# Altium schematic sheet project_13.SchDoc
size A4; SheetNumber: 1; SheetTotal: 1
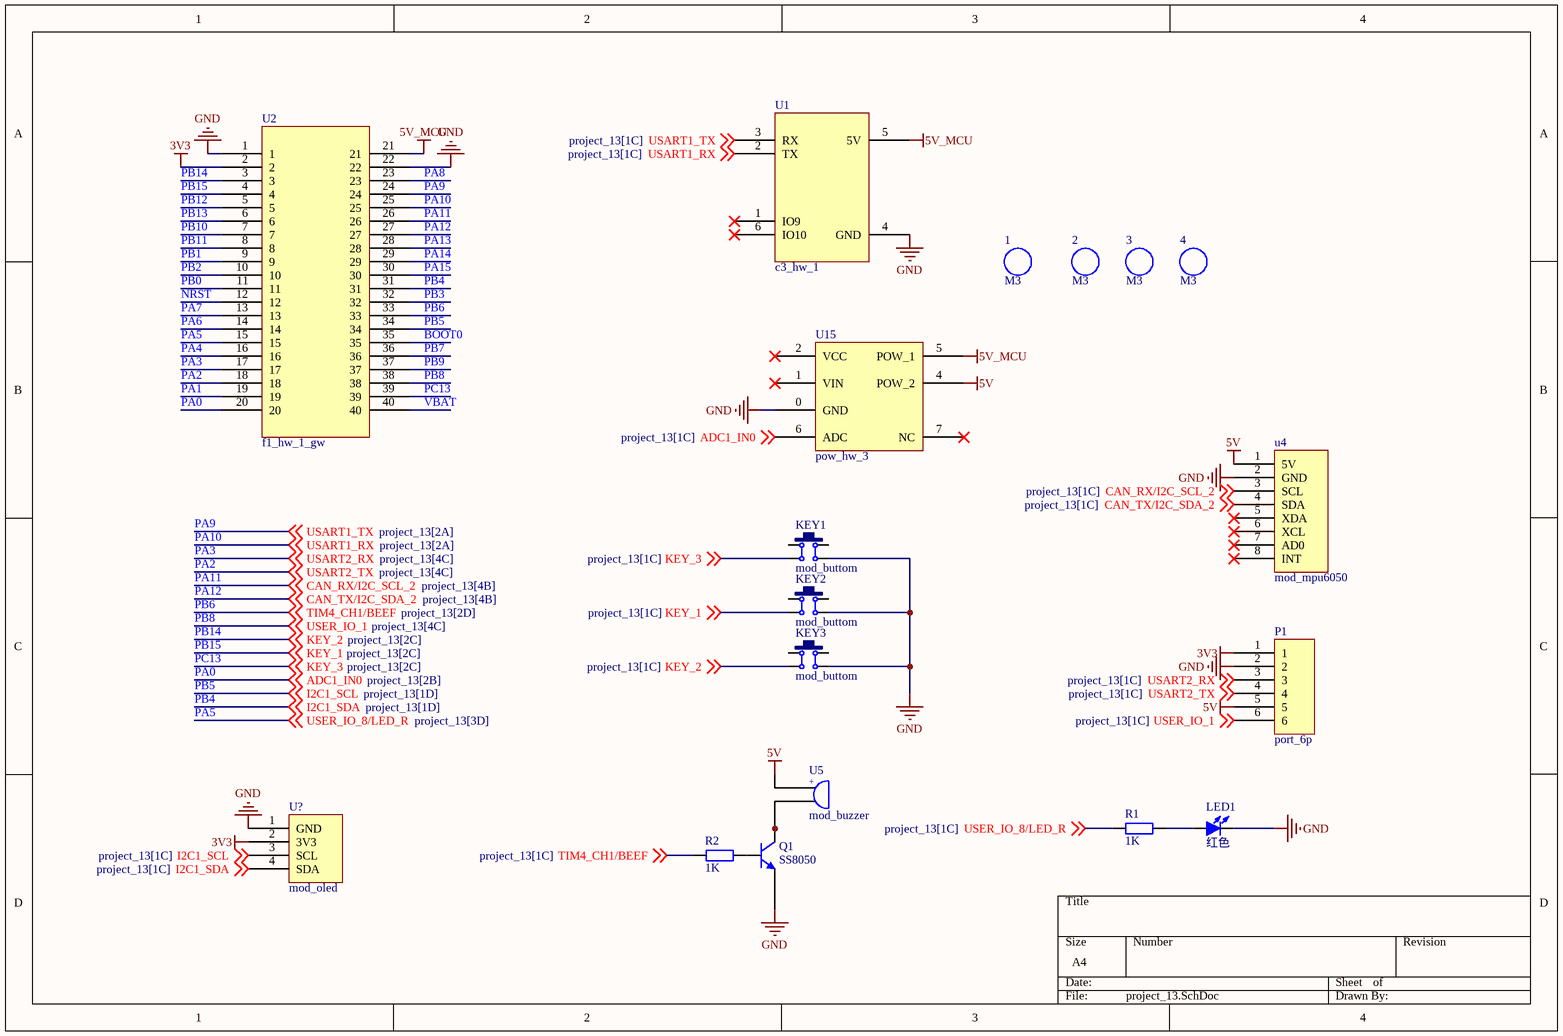
[diagram p0: project_13.SchDoc]

## Parts
1  M3  [M3 125X200]
2  M3  [M3 125X200]
3  M3  [M3 125X200]
4  M3  [M3 125X200]
KEY1  mod_buttom  [MOD_BUTTOM]
KEY2  mod_buttom  [MOD_BUTTOM]
KEY3  mod_buttom  [MOD_BUTTOM]
LED1  红色  [LED 3MM-R]
P1  port_6p  [MOD_GPS]
Q1  SS8050  [SOT23-3L]
R1  1K  [R 0603_L]
R2  1K  [R 0603_L]
U1  c3_hw_1  [C3_HW_1]
U2  f1_hw_1_gw  [F1_HW_1_GW]
u4  mod_mpu6050  [MOD_MPU6050]
U5  mod_buzzer  [MOD_BUZZER]
U15  pow_hw_3  [POW_HW_3]
U?  mod_oled  [mod_oled]

## Nets
3V3: P1.1 U2.2 U?.2(3V3)
5V: P1.5 u4.1(5V) U5.1 U15.4(POW_2)
5V_MCU: U1.5(5V) U2.21 U15.5(POW_1)
GND: KEY1.3 KEY2.3 KEY3.3 LED1.2(K) P1.2 Q1.2(E) U1.4(GND) U2.1 U2.22 u4.2(GND) U15.0(GND) U?.1(GND)
BOOT0: U2.35
NRST: U2.12
PA0: U2.20 U15.6(ADC) ; off-sheet ADC1_IN0  [also labelled ADC1_IN0]
PA1: U2.19
PA2: P1.4 U2.18 ; off-sheet USART2_TX  [also labelled USART2_TX]
PA3: P1.3 U2.17 ; off-sheet USART2_RX  [also labelled USART2_RX]
PA4: U2.16
PA5: R1.1 U2.15 ; off-sheet USER_IO_8/LED_R  [also labelled USER_IO_8/LED_R]
PA6: U2.14
PA7: U2.13
PA8: U2.23
PA9: U1.3(RX) U2.24 ; off-sheet USART1_TX  [also labelled USART1_TX]
PA10: U1.2(TX) U2.25 ; off-sheet USART1_RX  [also labelled USART1_RX]
PA11: U2.26 u4.3(SCL) ; off-sheet CAN_RX/I2C_SCL_2  [also labelled CAN_RX/I2C_SCL_2]
PA12: U2.27 u4.4(SDA) ; off-sheet CAN_TX/I2C_SDA_2  [also labelled CAN_TX/I2C_SDA_2]
PA13: U2.28
PA14: U2.29
PA15: U2.30
PB0: U2.11
PB1: U2.9
PB2: U2.10
PB3: U2.32
PB4: U2.31 U?.4(SDA) ; off-sheet I2C1_SDA  [also labelled I2C1_SDA]
PB5: U2.34 U?.3(SCL) ; off-sheet I2C1_SCL  [also labelled I2C1_SCL]
PB6: R2.1 U2.33 ; off-sheet TIM4_CH1/BEEF  [also labelled TIM4_CH1/BEEF]
PB7: U2.36
PB8: P1.6 U2.38 ; off-sheet USER_IO_1  [also labelled USER_IO_1]
PB9: U2.37
PB10: U2.7
PB11: U2.8
PB12: U2.5
PB13: U2.6
PB14: KEY3.4 U2.3 ; off-sheet KEY_2  [also labelled KEY_2]
PB15: KEY2.4 U2.4 ; off-sheet KEY_1  [also labelled KEY_1]
PC13: KEY1.4 U2.39 ; off-sheet KEY_3  [also labelled KEY_3]
VBAT: U2.40
NetLED1_1: LED1.1(A) R1.2
NetQ1_1: Q1.1(B) R2.2
NetQ1_3: Q1.3(C) U5.2

Not connected (* = marked no-connect by the designer): KEY1 1 2; KEY2 1 2; KEY3 1 2; U1 1(IO9)* 6(IO10)*; u4 5(XDA)* 6(XCL)* 7(AD0)* 8(INT)*; U15 1(VIN)* 2(VCC)* 7(NC)*

## Notes on the sheet
- (in symbol mod_buzzer) +

## Library data of the parts
1-4 = prot_m3: m3铜柱孔; BOM名称: 铜柱孔; 版权归属: 源创客; 学习资源: www.ooocke.com
KEY1-KEY3 = mod_buttom: 6*6*4.3按键
LED1 = LED-3MM: 插件LED; 版权归属: 源创客; BOM名称: 插件LED; 学习资源: www.ooocke.com
P1 = port_6p: 6P模块接口
Q1 = 8050-SMD: 高频放大-NPN型; 版权归属: 源创客; 属性: 40V 1.5A 1W 100MHZ; BOM名称: 高频放大-NPN型; 学习资源: www.ooocke.com
R1 R2 = R: 贴片电阻; 版权归属: 源创客; BOM名称: 贴片电阻; 学习资源: www.ooocke.com
U1 = c3_hw_1: ESP32C3蓝牙模块 / 6p排母
u4 = mod_mpu6050: 陀螺仪模块
U5 = mod_buzzer: 有源蜂鸣器
U15 = pow_hw_3: 两路降压电源模块
U? = mod_oled: oled模块 / 4p排母